# Altium schematic sheet [06] - MCU.SchDoc
size A3; DocumentNumber: 6; SheetNumber: 6; SheetTotal: 10
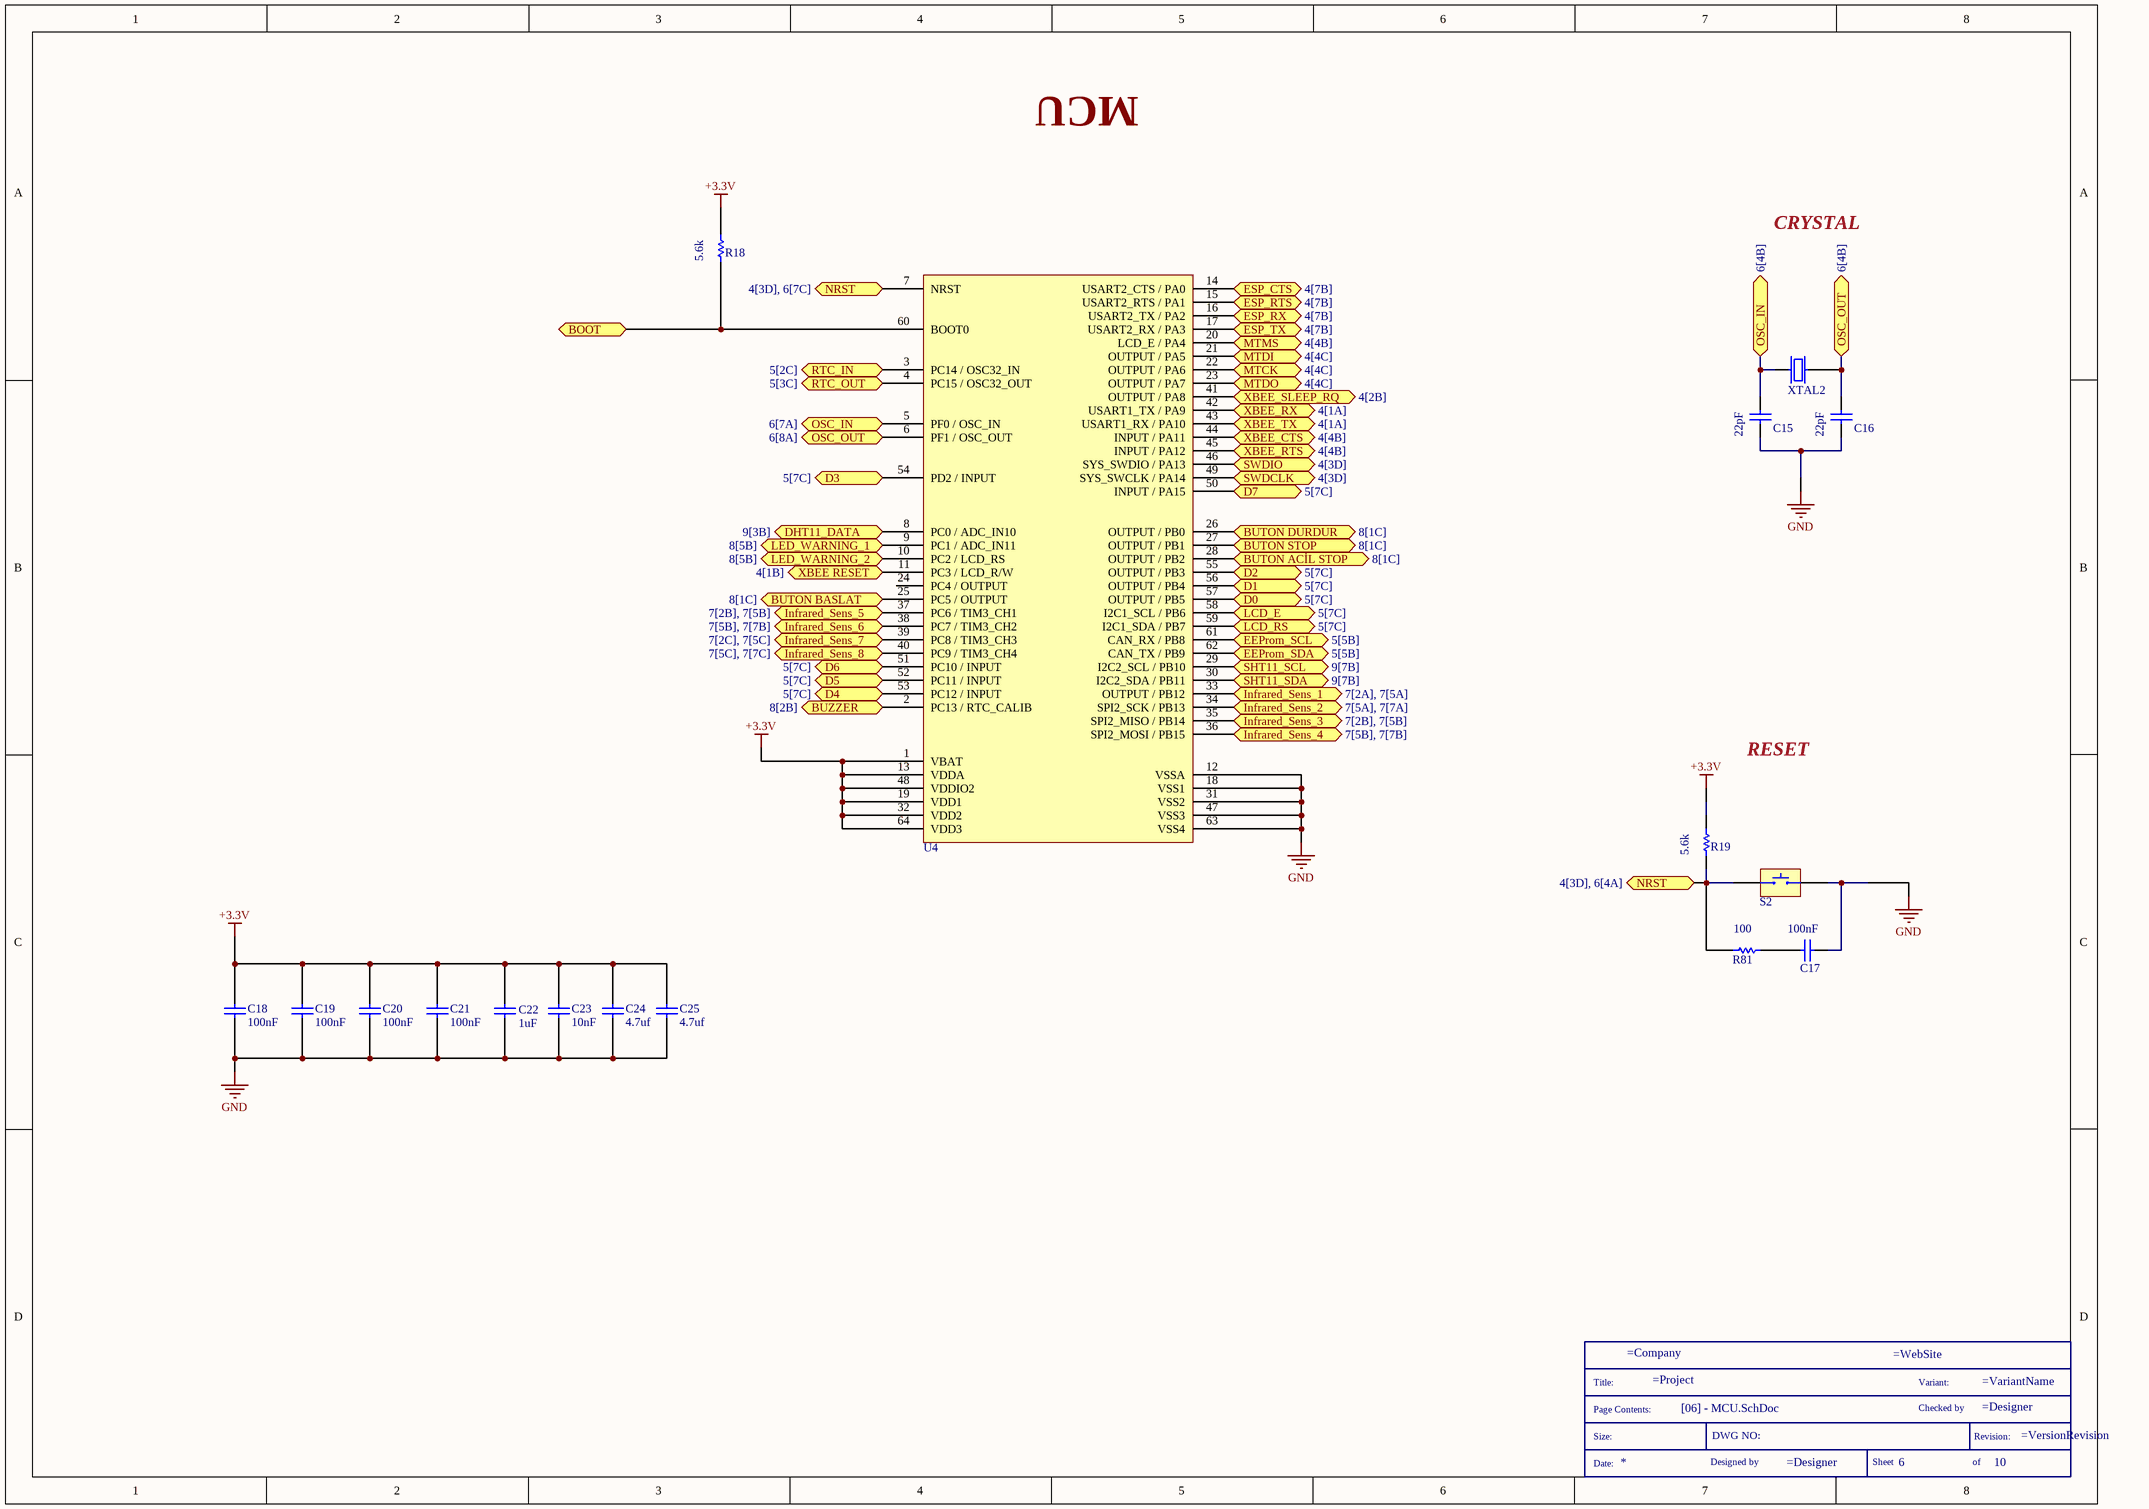
[diagram p0: [06] - MCU.SchDoc]

## Parts
*  SCH_TITLE  (value not drawn)  (graphical)
C15  22pF  [CAP_CER_0603]
C16  22pF  [CAP_CER_0603]
C17  100nF  [CAP_CER_0603]
C18  100nF  [CAP_CER_0603]
C19  100nF  [CAP_CER_0603]
C20  100nF  [CAP_CER_0603]
C21  100nF  [CAP_CER_0603]
C22  1uF  [CAP_CER_0603]
C23  10nF  [CAP_CER_0805]
C24  4.7uf  [CAP_CER_0603]
C25  4.7uf  [CAP_CER_0603]
R18  5.6k  [RES_0805]
R19  5.6k  [RES_0805]
R81  100  [RES_0805]
S2  TAC SW  [TAC-SW]  (value not drawn)
U4  STM32F072R8T6TR  [LQFP64]  (value not drawn)
XTAL2  8Mhz  [HC-49/US]  (value not drawn)

## Ports
BOOT, BUTON ACİL STOP (see 8[1C]), BUTON BASLAT (see 8[1C]), BUTON DURDUR (see 8[1C]), BUTON STOP (see 8[1C]), BUZZER (see 8[2B]), D0 (see 5[7C]), D1 (see 5[7C]), D2 (see 5[7C]), D3 (see 5[7C]), D4 (see 5[7C]), D5 (see 5[7C]), D6 (see 5[7C]), D7 (see 5[7C]), DHT11_DATA (see 9[3B]), EEProm_SCL (see 5[5B]), EEProm_SDA (see 5[5B]), ESP_CTS (see 4[7B]), ESP_RTS (see 4[7B]), ESP_RX (see 4[7B]), ESP_TX (see 4[7B]), Infrared_Sens_1 (see 7[2A], 7[5A]), Infrared_Sens_2 (see 7[5A], 7[7A]), Infrared_Sens_3 (see 7[2B], 7[5B]), Infrared_Sens_4 (see 7[5B], 7[7B]), Infrared_Sens_5 (see 7[2B], 7[5B]), Infrared_Sens_6 (see 7[5B], 7[7B]), Infrared_Sens_7 (see 7[2C], 7[5C]), Infrared_Sens_8 (see 7[5C], 7[7C]), LCD_E (see 5[7C]), LCD_RS (see 5[7C]), LED_WARNING_1 (see 8[5B]), LED_WARNING_2 (see 8[5B]), MTCK (see 4[4C]), MTDI (see 4[4C]), MTDO (see 4[4C]), MTMS (see 4[4B]), NRST (see 4[3D], 6[4A]), NRST (see 4[3D], 6[7C]), OSC_IN (see 6[4B]), OSC_IN (see 6[7A]), OSC_OUT (see 6[4B]), OSC_OUT (see 6[8A]), RTC_IN (see 5[2C]), RTC_OUT (see 5[3C]), SHT11_SCL (see 9[7B]), SHT11_SDA (see 9[7B]), SWDCLK (see 4[3D]), SWDIO (see 4[3D]), XBEE RESET (see 4[1B]), XBEE_CTS (see 4[4B]), XBEE_RTS (see 4[4B]), XBEE_RX (see 4[1A]), XBEE_SLEEP_RQ (see 4[2B]), XBEE_TX (see 4[1A])

## Nets
+3.3V: C18.2 C19.2 C20.2 C21.2 C22.2 C23.2 C24.2 C25.2 R18.2 R19.2 U4.1(VBAT) U4.13(VDDA) U4.19(VDD1) U4.32(VDD2) U4.48(VDDIO2) U4.64(VDD3)
GND: C15.1 C16.1 C17.2 C18.1 C19.1 C20.1 C21.1 C22.1 C23.1 C24.1 C25.1 S2.2 U4.12(VSSA) U4.18(VSS1) U4.31(VSS2) U4.47(VSS3) U4.63(VSS4)
BOOT: R18.1 U4.60(BOOT0) ; port BOOT
BUTON ACİL STOP: U4.28(OUTPUT_/_PB2) ; port BUTON ACİL STOP
BUTON BASLAT: U4.25(PC5_/_OUTPUT) ; port BUTON BASLAT
BUTON DURDUR: U4.26(OUTPUT_/_PB0) ; port BUTON DURDUR
BUTON STOP: U4.27(OUTPUT_/_PB1) ; port BUTON STOP
BUZZER: U4.2(PC13_/_RTC_CALIB) ; port BUZZER
D0: U4.57(OUTPUT_/_PB5) ; port D0
D1: U4.56(OUTPUT_/_PB4) ; port D1
D2: U4.55(OUTPUT_/_PB3) ; port D2
D3: U4.54(PD2_/_INPUT) ; port D3
D4: U4.53(PC12_/_INPUT) ; port D4
D5: U4.52(PC11_/_INPUT) ; port D5
D6: U4.51(PC10_/_INPUT) ; port D6
D7: U4.50(INPUT_/_PA15) ; port D7
DHT11_DATA: U4.8(PC0_/_ADC_IN10) ; port DHT11_DATA
EEProm_SCL: U4.61(CAN_RX_/_PB8) ; port EEProm_SCL
EEProm_SDA: U4.62(CAN_TX_/_PB9) ; port EEProm_SDA
ESP_CTS: U4.14(USART2_CTS_/_PA0) ; port ESP_CTS
ESP_RTS: U4.15(USART2_RTS_/_PA1) ; port ESP_RTS
ESP_RX: U4.16(USART2_TX_/_PA2) ; port ESP_RX
ESP_TX: U4.17(USART2_RX_/_PA3) ; port ESP_TX
Infrared_Sens_1: U4.33(OUTPUT_/_PB12) ; port Infrared_Sens_1
Infrared_Sens_2: U4.34(SPI2_SCK_/_PB13) ; port Infrared_Sens_2
Infrared_Sens_3: U4.35(SPI2_MISO_/_PB14) ; port Infrared_Sens_3
Infrared_Sens_4: U4.36(SPI2_MOSI_/_PB15) ; port Infrared_Sens_4
Infrared_Sens_5: U4.37(PC6_/_TIM3_CH1) ; port Infrared_Sens_5
Infrared_Sens_6: U4.38(PC7_/_TIM3_CH2) ; port Infrared_Sens_6
Infrared_Sens_7: U4.39(PC8_/_TIM3_CH3) ; port Infrared_Sens_7
Infrared_Sens_8: U4.40(PC9_/_TIM3_CH4) ; port Infrared_Sens_8
LCD_E: U4.58(I2C1_SCL_/_PB6) ; port LCD_E
LCD_RS: U4.59(I2C1_SDA_/_PB7) ; port LCD_RS
LED_WARNING_1: U4.9(PC1_/_ADC_IN11) ; port LED_WARNING_1
LED_WARNING_2: U4.10(PC2_/_LCD_RS) ; port LED_WARNING_2
MTCK: U4.22(OUTPUT_/_PA6) ; port MTCK
MTDI: U4.21(OUTPUT_/_PA5) ; port MTDI
MTDO: U4.23(OUTPUT_/_PA7) ; port MTDO
MTMS: U4.20(LCD_E_/_PA4) ; port MTMS
NRST: R19.1 R81.1 S2.1 U4.7(NRST) ; port NRST
OSC_IN: C15.2 U4.5(PF0_/_OSC_IN) XTAL2.1 ; port OSC_IN
OSC_OUT: C16.2 U4.6(PF1_/_OSC_OUT) XTAL2.2 ; port OSC_OUT
RTC_IN: U4.3(PC14_/_OSC32_IN) ; port RTC_IN
RTC_OUT: U4.4(PC15_/_OSC32_OUT) ; port RTC_OUT
SHT11_SCL: U4.29(I2C2_SCL_/_PB10) ; port SHT11_SCL
SHT11_SDA: U4.30(I2C2_SDA_/_PB11) ; port SHT11_SDA
SWDCLK: U4.49(SYS_SWCLK_/_PA14) ; port SWDCLK
SWDIO: U4.46(SYS_SWDIO_/_PA13) ; port SWDIO
XBEE RESET: U4.11(PC3_/_LCD_R/W) ; port XBEE RESET
XBEE_CTS: U4.44(INPUT_/_PA11) ; port XBEE_CTS
XBEE_RTS: U4.45(INPUT_/_PA12) ; port XBEE_RTS
XBEE_RX: U4.42(USART1_TX_/_PA9) ; port XBEE_RX
XBEE_SLEEP_RQ: U4.41(OUTPUT_/_PA8) ; port XBEE_SLEEP_RQ
XBEE_TX: U4.43(USART1_RX_/_PA10) ; port XBEE_TX
NetC17_1: C17.1 R81.2

Not connected (* = marked no-connect by the designer): U4 24(PC4_/_OUTPUT)

## Notes on the sheet
- MCU
- CRYSTAL
- RESET
- (in symbol SCH_TITLE) Title:; Variant:; Page Contents:; Checked by; Size:; DWG NO:; Revision:; Date:; Designed by; Sheet; of

## Library data of the parts
* = SCH_TITLE: Schematic information
C15 C16 = GCM1885C2A220FA16D: CAP CER 22PF 100V C0G/NP0 0603; Manufacturer 1: Murata Electronics North America; Category: Ceramic Capacitors; Manufacturer Part Number 1: GCM1885C2A220FA16D; Case/Package: 0603 (1608 Metric); Quantity: 1; Supplier 1: Digikey; Supplier Part Number 1: 490-16413-1-ND; Supplier Order Qty 1: 1; Supplier Stock 1: 22604; Supplier Unit Price 1: 0,22; Supplier Currency 1: $
C17-C21 = GMK107BJ104KAHT: CAP CER 100nf 35V X5R 0603; Manufacturer 1: Taiyo Yuden; Category: Ceramic Capacitors; Manufacturer Part Number 1: GMK107BJ104KAHT; Case/Package: 0603 (1608 Metric); Quantity: 1; Supplier 1: Digikey; Supplier Part Number 1: 587-3357-1-ND; Supplier Order Qty 1: 1; Supplier Stock 1: 97932; Supplier Unit Price 1: 0,14; Supplier Currency 1: $
C22 = CGA3E3X5R1V105K080AB: CAP CER 1UF 35V; Manufacturer 1: TDK Corporation; Category: Ceramic Capacitors; Manufacture Part Number 1: CGA3E3X5R1V105K080AB; Case/Package: 0603 (1608 Metric); Quantity: 1; Supplier 1: Digikey; Supplier Part Number 1: 445-12484-1-ND; Supplier Order Qty 1: 1; Supplier Stock 1: 11910; Supplier Unit Price 1: 0,25; Supplier Currency 1: $
C23 = CL21B103KC6WPNC: CAP CER 10nF 100V; Manufacturer 1: Samsung Electro-Mechanics; Category: Ceramic Capacitors; Manufacturer Part Number 1: CL21B103KC6WPNC; Case/Package: 0805 (2012 Metric); Quantity: 1; Supplier 1: Digikey; Supplier Part Number 1: 1276-6845-1-ND; Supplier Order Qty 1: 1; Supplier Stock 1: 38701; Supplier Unit Price 1: 0,1; Supplier Currency 1: $
C24 C25 = CGA3E2C0G1H4R7C080AA: CAP CER 4.7PF 50V C0G 0603; Manufacturer 1: TDK Corporation; Category: Ceramic Capacitors; Manufacturer Part Number 1: CGA3E2C0G1H4R7C080AA; Case/Package: 0603 (1608 Metric); Quantity: 1; Supplier 1: Digikey; Supplier Part Number 1: 445-5621-1-ND; Supplier Stock 1: 68332; Supplier Unit Price 1: 0.19; Supplier Currency 1: $
R18 R19 = ERJ-6ENF5601V: RES SMD 5.6K OHM 1% 1/8W 0805; Manufacturer 1: Panasonic Electronic Components; Category: Chip Resistor - Surface Mount; Manufacturer Part Number 1: ERJ-6ENF5601V; Case/Package: 0805 (2012 Metric); Quantity: 1; Supplier 1: Digikey; Supplier Part Number 1: P5.60KCCT-ND; Supplier Order Qty 1: 1; Supplier Stock 1: 71341; Supplier Unit Price 1: 0,1; Supplier Currency 1: $
R81 = ERJ-6ENF1000V: RES SMD 100 OHM; Manufacturer 1: Panasonic Electronic Components; Category: Chip Resistor - Surface Mount; Manufacturer Part Number 1: ERJ-6ENF1000V; Case/Package: 0805 (2012 Metric); Quantity: 1; Supplier 1: Digikey; Supplier Part Number 1: P100CCT-ND; Supplier Order Qty 1: 1; Supplier Stock 1: 728141; Supplier Unit Price 1: 0,1; Supplier Currency 1: $
S2 = FSMSMTR: SWITCH TACTILE SPST-NO 0.05A 24V; Manufacturer 1: TE Connectivity ALCOSWITCH Switches; Category: Tactile Switches; Manufacturer Part Number 1: FSMSMTR; Case/Package: *; Quantity: 1; Supplier 1: Digikey; Supplier Part Number 1: 450-1758-1-ND; Supplier Order Qty 1: 1; Supplier Stock 1: 28743; Supplier Unit Price 1: 0,47; Supplier Currency 1: $
U4 = STM32F072R8T6TR: IC MCU 32BIT 64KB FLASH 64LQFP; Manufacturer 1: STMicroelectronics; Category: Embedded - Microcontrollers; Manufacture Part Number 1: STM32F072R8T6TR; Case/Package: 64-LQFP; Quantity: 1; Supplier 1: Digikey; Supplier Part Number 1: 497-17362-1-ND; Supplier Order Qty 1: 1; Supplier Stock 1: 441; Supplier Unit Price 1: 3,84; Supplier Currency 1: $
XTAL2 = ECS-80-18-5PLX-AGN-TR: CRYSTAL 8.000MHZ 18PF SMT; Manufacturer 1: ECS Inc.; Category: Crystals; Manufacturer Part Number 1: ECS-80-18-5PLX-AGN-TR; Case/Package: HC-49/US; Quantity: 1; Supplier 1: Digikey; Supplier Part Number 1: XC2782CT-ND; Supplier Stock 1: 1600; Supplier Unit Price 1: 0.37; Supplier Currency 1: $